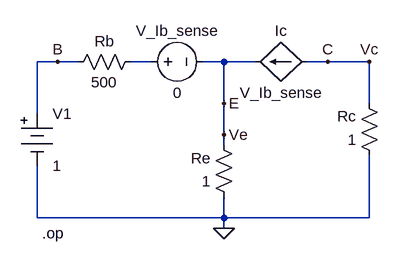
[diagram p0: schematic g3_p27.asc]
g3_p27.asc, the LTspice schematic file:
Version 4
SHEET 1 880 680
WIRE -16 80 -48 80
WIRE 16 80 -16 80
WIRE 128 80 96 80
WIRE 240 80 208 80
WIRE 288 80 240 80
WIRE 400 80 368 80
WIRE 464 80 400 80
WIRE 240 144 240 80
WIRE 464 144 464 80
WIRE -48 160 -48 80
WIRE 240 192 240 144
WIRE 240 208 240 192
WIRE -48 320 -48 240
WIRE 240 320 240 288
WIRE 240 320 -48 320
WIRE 464 320 464 224
WIRE 464 320 240 320
WIRE 240 336 240 320
FLAG 240 336 0
FLAG 464 80 Vc
FLAG 240 192 Ve
FLAG -16 80 B
FLAG 400 80 C
FLAG 240 144 E
SYMBOL Misc\\battery -48 144 R0
SYMATTR InstName V1
SYMATTR Value 1
SYMBOL res 112 64 R90
WINDOW 0 0 56 VBottom 2
WINDOW 3 32 56 VTop 2
SYMATTR InstName Rb
SYMATTR Value 500
SYMBOL res 256 304 R180
WINDOW 0 36 76 Left 2
WINDOW 3 36 40 Left 2
SYMATTR InstName Re
SYMATTR Value 1
SYMBOL res 480 240 R180
WINDOW 0 36 76 Left 2
WINDOW 3 36 40 Left 2
SYMATTR InstName Rc
SYMATTR Value 1
SYMBOL f 368 80 R90
WINDOW 0 -32 40 VBottom 2
WINDOW 3 32 40 VTop 2
SYMATTR InstName Ic
SYMATTR Value V_Ib_sense
SYMATTR Value2 200
SYMBOL voltage 112 80 R270
WINDOW 0 32 56 VTop 2
WINDOW 3 -32 56 VBottom 2
SYMATTR InstName V_Ib_sense
SYMATTR Value 0
TEXT -40 344 Left 2 !.op

The netlist it stands for:
* g3_p27.asc
V1 B 0 1
Rb N001 B 500
Re 0 E 1
Rc 0 C 1
F§Ic C E V_Ib_sense 200
V_Ib_sense N001 E 0
.op
.backanno
.end